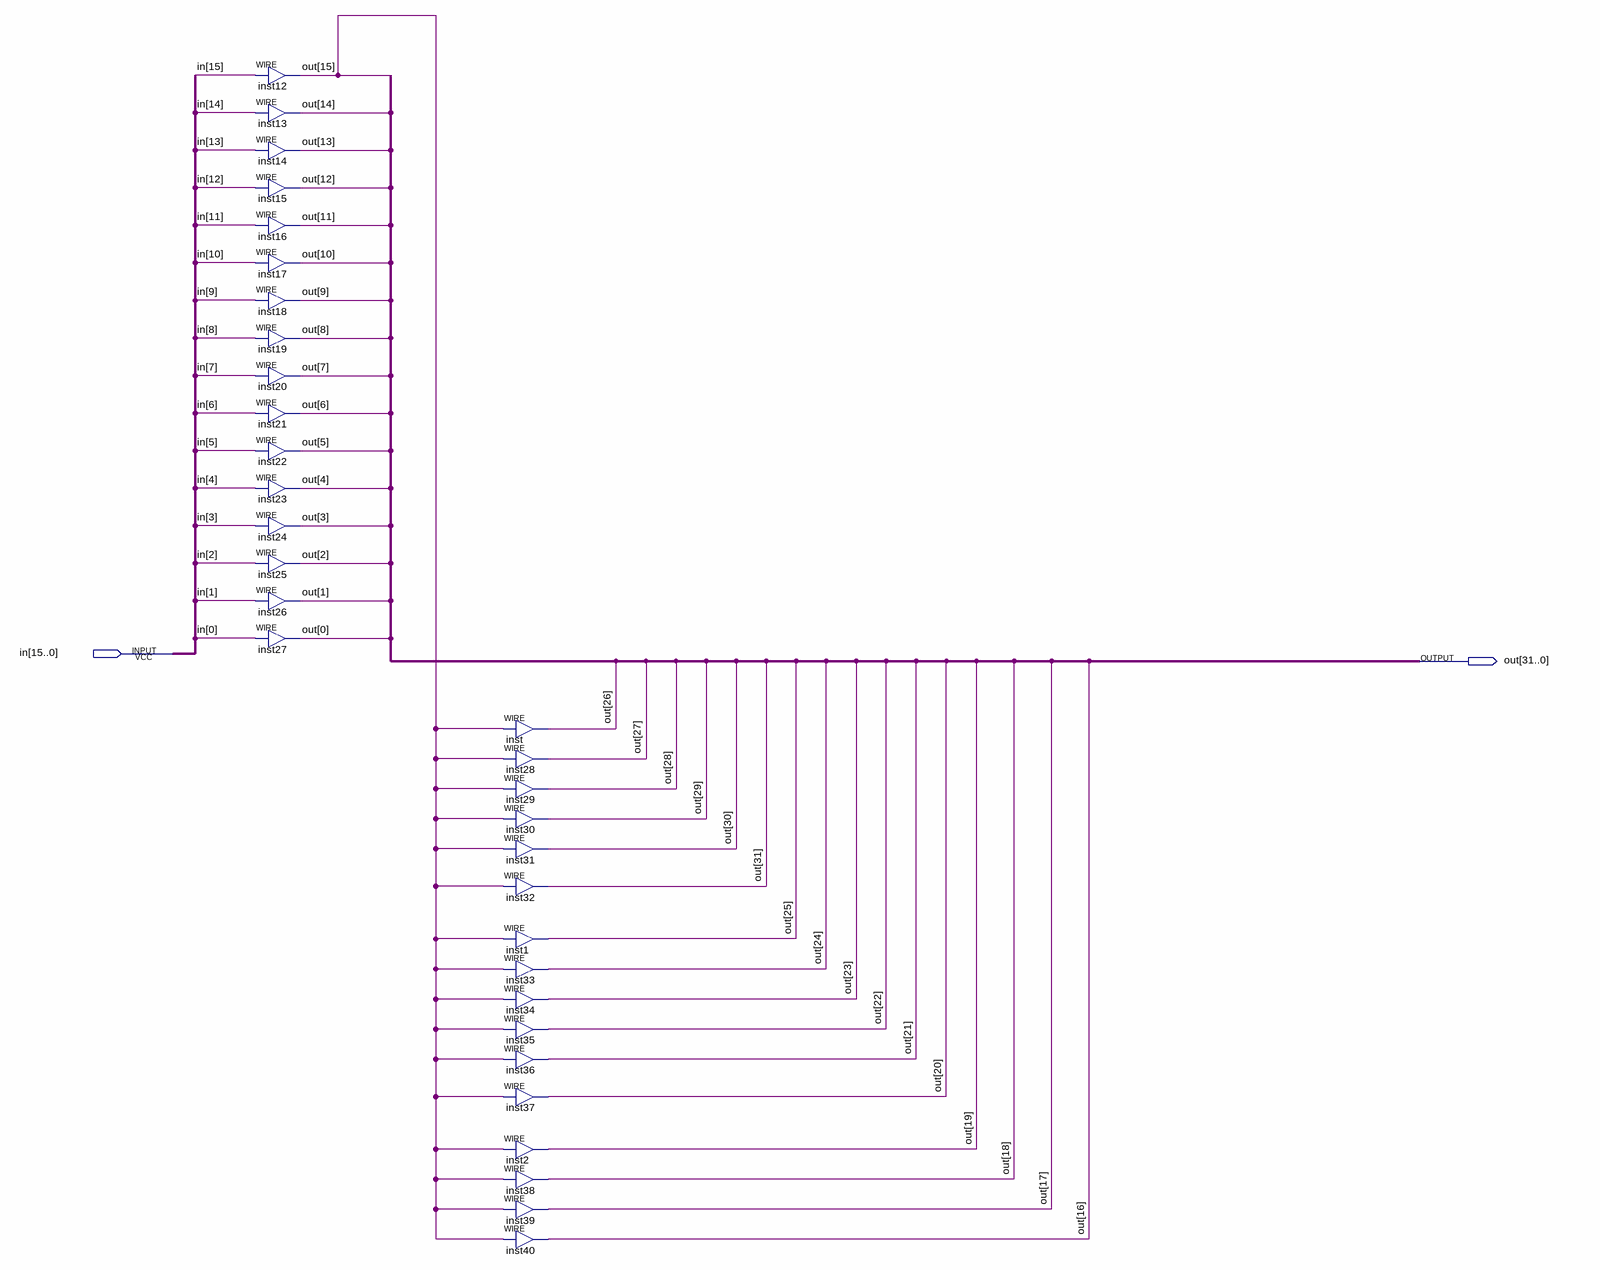
[diagram p0: schematic sheet]
// Quartus schematic extensor16bits.bdf as structural Verilog: 32 symbols, 2 pins
module extensor16bits (
  input  [15:0] in,
  output [31:0] out
);

  assign out[15] = in[15];  // WIRE inst12
  assign out[14] = in[14];  // WIRE inst13
  assign out[13] = in[13];  // WIRE inst14
  assign out[12] = in[12];  // WIRE inst15
  assign out[11] = in[11];  // WIRE inst16
  assign out[10] = in[10];  // WIRE inst17
  assign out[9] = in[9];  // WIRE inst18
  assign out[8] = in[8];  // WIRE inst19
  assign out[7] = in[7];  // WIRE inst20
  assign out[6] = in[6];  // WIRE inst21
  assign out[5] = in[5];  // WIRE inst22
  assign out[4] = in[4];  // WIRE inst23
  assign out[3] = in[3];  // WIRE inst24
  assign out[2] = in[2];  // WIRE inst25
  assign out[1] = in[1];  // WIRE inst26
  assign out[0] = in[0];  // WIRE inst27
  assign out[26] = out[15];  // WIRE inst
  assign out[27] = out[15];  // WIRE inst28
  assign out[28] = out[15];  // WIRE inst29
  assign out[29] = out[15];  // WIRE inst30
  assign out[30] = out[15];  // WIRE inst31
  assign out[31] = out[15];  // WIRE inst32
  assign out[25] = out[15];  // WIRE inst1
  assign out[24] = out[15];  // WIRE inst33
  assign out[23] = out[15];  // WIRE inst34
  assign out[22] = out[15];  // WIRE inst35
  assign out[21] = out[15];  // WIRE inst36
  assign out[20] = out[15];  // WIRE inst37
  assign out[19] = out[15];  // WIRE inst2
  assign out[18] = out[15];  // WIRE inst38
  assign out[17] = out[15];  // WIRE inst39
  assign out[16] = out[15];  // WIRE inst40
endmodule
